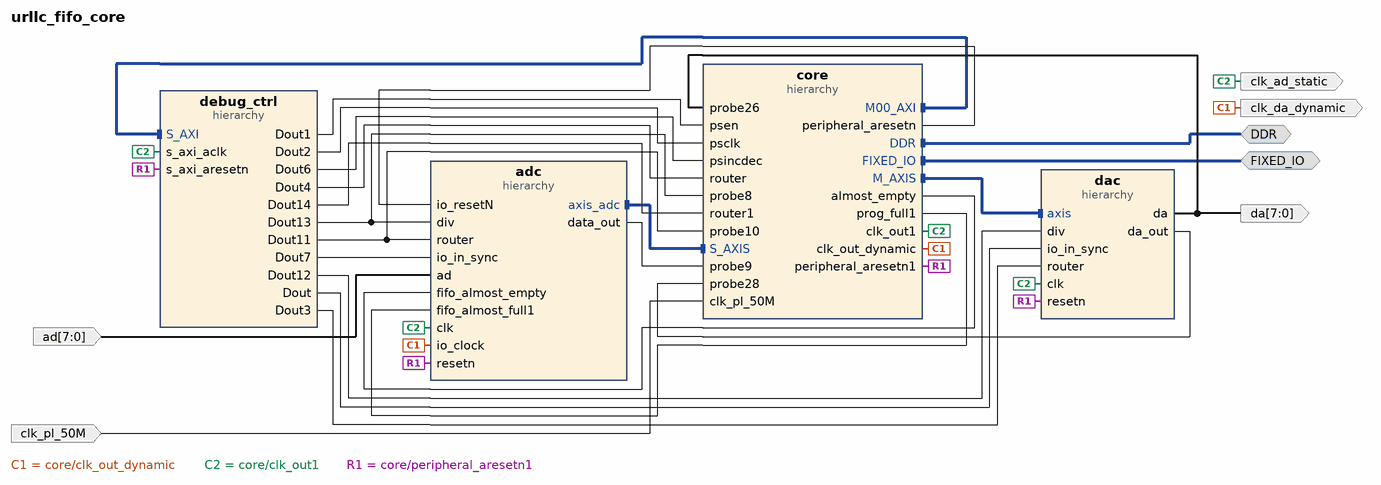
[diagram p0: block diagram of the top level]
# Vivado block design urllc_fifo_core, xc7z020clg400-2, Vivado 2018.3
create_bd_design urllc_fifo_core

create_bd_intf_port -mode Master -vlnv xilinx.com:interface:ddrx_rtl:1.0 DDR
create_bd_intf_port -mode Master -vlnv xilinx.com:display_processing_system7:fixedio_rtl:1.0 FIXED_IO
create_bd_port -dir I -from 7 -to 0 ad
create_bd_port -dir O -type clk clk_ad_static
set_property -dict {CONFIG.FREQ_HZ 60000000} [get_bd_ports clk_ad_static]
create_bd_port -dir O -type clk clk_da_dynamic
set_property -dict {CONFIG.FREQ_HZ 60000000} [get_bd_ports clk_da_dynamic]
create_bd_port -dir I -type clk clk_pl_50M
set_property -dict {CONFIG.FREQ_HZ 50000000} [get_bd_ports clk_pl_50M]
create_bd_port -dir O -from 7 -to 0 da

create_bd_cell -type hier adc
create_bd_cell -type hier core
create_bd_cell -type hier dac
create_bd_cell -type hier debug_ctrl

# ---- hierarchy /adc ----
current_bd_instance /adc
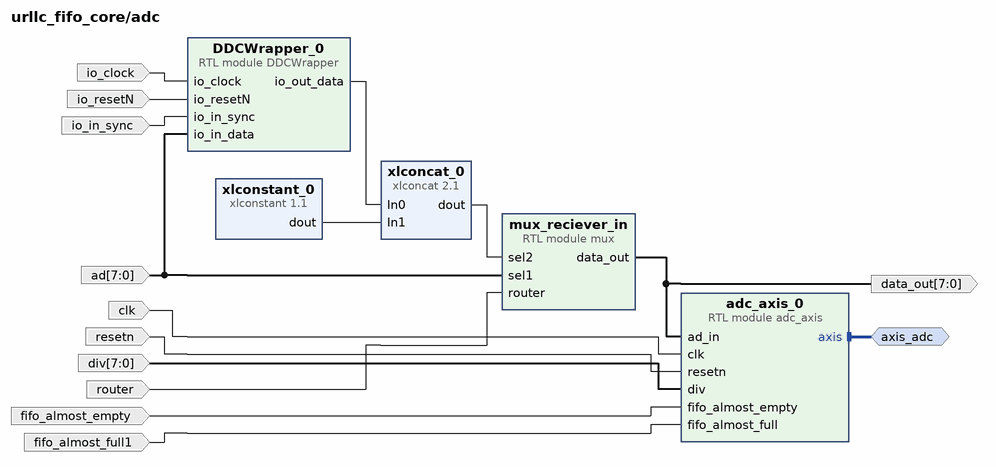
[diagram p1: block diagram inside /adc]
create_bd_intf_pin -mode Master -vlnv xilinx.com:interface:axis_rtl:1.0 axis_adc
create_bd_pin -dir I -from 7 -to 0 ad
create_bd_pin -dir I -type clk clk
create_bd_pin -dir I -from 7 -to 0 div
create_bd_pin -dir I -type clk io_clock
create_bd_pin -dir I io_in_sync
create_bd_pin -dir I -type rst io_resetN
create_bd_pin -dir I -type rst resetn
create_bd_pin -dir I router
create_bd_pin -dir O -from 7 -to 0 data_out
create_bd_pin -dir I fifo_almost_empty
create_bd_pin -dir I fifo_almost_full1

create_bd_cell -type module -reference DDCWrapper DDCWrapper_0
create_bd_cell -type ip -vlnv xilinx.com:ip:xlconcat:2.1 xlconcat_0
create_bd_cell -type ip -vlnv xilinx.com:ip:xlconstant:1.1 xlconstant_0
set_property -dict {CONFIG.CONST_VAL 0 CONFIG.CONST_WIDTH 7} [get_bd_cells xlconstant_0]
create_bd_cell -type module -reference adc_axis adc_axis_0
create_bd_cell -type module -reference mux mux_reciever_in

# ---- hierarchy /core ----
current_bd_instance /core
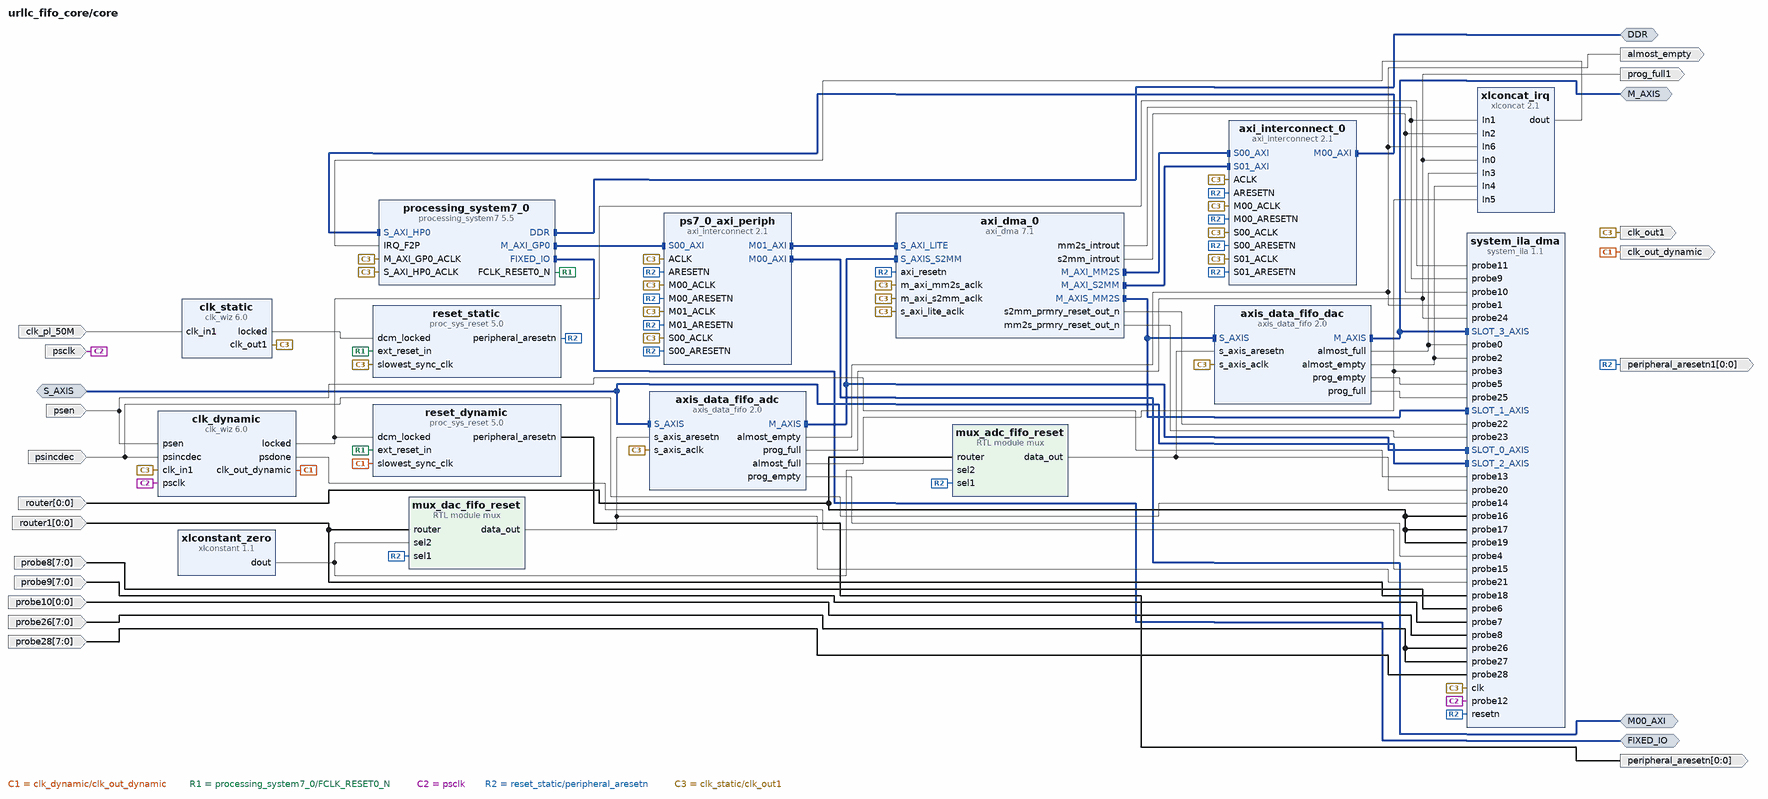
[diagram p2: block diagram inside /core]
create_bd_intf_pin -mode Master -vlnv xilinx.com:interface:ddrx_rtl:1.0 DDR
create_bd_intf_pin -mode Master -vlnv xilinx.com:display_processing_system7:fixedio_rtl:1.0 FIXED_IO
create_bd_intf_pin -mode Master -vlnv xilinx.com:interface:aximm_rtl:1.0 M00_AXI
create_bd_intf_pin -mode Slave -vlnv xilinx.com:interface:axis_rtl:1.0 S_AXIS
create_bd_intf_pin -mode Master -vlnv xilinx.com:interface:axis_rtl:1.0 M_AXIS
create_bd_pin -dir O -type clk clk_out1
create_bd_pin -dir O -type clk clk_out_dynamic
create_bd_pin -dir I clk_pl_50M
create_bd_pin -dir O -from 0 -to 0 -type rst peripheral_aresetn
create_bd_pin -dir O -from 0 -to 0 -type rst peripheral_aresetn1
create_bd_pin -dir I psclk
create_bd_pin -dir I psen
create_bd_pin -dir I psincdec
create_bd_pin -dir I -from 0 -to 0 router
create_bd_pin -dir I -from 0 -to 0 router1
create_bd_pin -dir I -from 7 -to 0 probe8
create_bd_pin -dir I -from 7 -to 0 probe9
create_bd_pin -dir I -from 0 -to 0 probe10
create_bd_pin -dir I -from 7 -to 0 probe26
create_bd_pin -dir I -from 7 -to 0 probe28
create_bd_pin -dir O almost_empty
create_bd_pin -dir O prog_full1

create_bd_cell -type ip -vlnv xilinx.com:ip:axi_dma:7.1 axi_dma_0
set_property -dict [list \
  CONFIG.c_include_sg 0 \
  CONFIG.c_m_axis_mm2s_tdata_width 8 \
  CONFIG.c_mm2s_burst_size 256 \
  CONFIG.c_s2mm_burst_size 256 \
  CONFIG.c_sg_length_width 24 \
] [get_bd_cells axi_dma_0]
create_bd_cell -type ip -vlnv xilinx.com:ip:clk_wiz:6.0 clk_dynamic
set_property -dict [list \
  CONFIG.CLKIN1_JITTER_PS 166.66 \
  CONFIG.CLKOUT1_JITTER 163.829 \
  CONFIG.CLKOUT1_PHASE_ERROR 130.371 \
  CONFIG.CLKOUT1_REQUESTED_OUT_FREQ 60 \
  CONFIG.CLK_OUT1_PORT clk_out_dynamic \
  CONFIG.MMCM_CLKFBOUT_MULT_F 17.000 \
  CONFIG.MMCM_CLKIN1_PERIOD 16.667 \
  CONFIG.MMCM_CLKIN2_PERIOD 10.0 \
  CONFIG.MMCM_CLKOUT0_DIVIDE_F 17.000 \
  CONFIG.MMCM_DIVCLK_DIVIDE 1 \
  CONFIG.PRIM_IN_FREQ 60.000 \
  CONFIG.PRIM_SOURCE Global_buffer \
  CONFIG.RESET_PORT reset \
  CONFIG.RESET_TYPE ACTIVE_HIGH \
  CONFIG.USE_DYN_PHASE_SHIFT true \
  CONFIG.USE_RESET false \
] [get_bd_cells clk_dynamic]
create_bd_cell -type ip -vlnv xilinx.com:ip:clk_wiz:6.0 clk_static
set_property -dict [list \
  CONFIG.CLKIN1_JITTER_PS 200.0 \
  CONFIG.CLKOUT1_JITTER 180.523 \
  CONFIG.CLKOUT1_PHASE_ERROR 162.874 \
  CONFIG.CLKOUT1_REQUESTED_OUT_FREQ 60.000 \
  CONFIG.MMCM_CLKFBOUT_MULT_F 20.250 \
  CONFIG.MMCM_CLKIN1_PERIOD 20.000 \
  CONFIG.MMCM_CLKIN2_PERIOD 10.0 \
  CONFIG.MMCM_CLKOUT0_DIVIDE_F 16.875 \
  CONFIG.MMCM_DIVCLK_DIVIDE 1 \
  CONFIG.PRIM_SOURCE Single_ended_clock_capable_pin \
  CONFIG.RESET_PORT reset \
  CONFIG.RESET_TYPE ACTIVE_HIGH \
  CONFIG.USE_RESET false \
] [get_bd_cells clk_static]
create_bd_cell -type ip -vlnv xilinx.com:ip:processing_system7:5.5 processing_system7_0
set_property -dict [list \
  CONFIG.PCW_APU_PERIPHERAL_FREQMHZ 666.666666 \
  CONFIG.PCW_CPU_CPU_6X4X_MAX_RANGE 767 \
  CONFIG.PCW_ENET0_ENET0_IO {MIO 16 .. 27} \
  CONFIG.PCW_ENET0_GRP_MDIO_ENABLE 1 \
  CONFIG.PCW_ENET0_GRP_MDIO_IO EMIO \
  CONFIG.PCW_ENET0_PERIPHERAL_ENABLE 1 \
  CONFIG.PCW_EN_CLK0_PORT 0 \
  CONFIG.PCW_FPGA0_PERIPHERAL_FREQMHZ 50 \
  CONFIG.PCW_FPGA1_PERIPHERAL_FREQMHZ 50 \
  CONFIG.PCW_GPIO_MIO_GPIO_ENABLE 0 \
  CONFIG.PCW_IRQ_F2P_INTR 1 \
  CONFIG.PCW_PERIPHERAL_BOARD_PRESET None \
  CONFIG.PCW_PRESET_BANK1_VOLTAGE {LVCMOS 1.8V} \
  CONFIG.PCW_QSPI_GRP_SINGLE_SS_ENABLE 1 \
  CONFIG.PCW_QSPI_GRP_SINGLE_SS_IO {MIO 1 .. 6} \
  CONFIG.PCW_QSPI_PERIPHERAL_ENABLE 1 \
  CONFIG.PCW_QSPI_QSPI_IO {MIO 1 .. 6} \
  CONFIG.PCW_SD0_GRP_CD_ENABLE 0 \
  CONFIG.PCW_SD0_GRP_WP_ENABLE 0 \
  CONFIG.PCW_SD0_PERIPHERAL_ENABLE 1 \
  CONFIG.PCW_SD0_SD0_IO {MIO 40 .. 45} \
  CONFIG.PCW_SDIO_PERIPHERAL_FREQMHZ 100 \
  CONFIG.PCW_SINGLE_QSPI_DATA_MODE x4 \
  CONFIG.PCW_UART1_PERIPHERAL_ENABLE 1 \
  CONFIG.PCW_UART1_UART1_IO {MIO 48 .. 49} \
  CONFIG.PCW_UART_PERIPHERAL_FREQMHZ 100 \
  CONFIG.PCW_UIPARAM_DDR_BUS_WIDTH {16 Bit} \
  CONFIG.PCW_UIPARAM_DDR_FREQ_MHZ 533.333333 \
  CONFIG.PCW_UIPARAM_DDR_PARTNO {MT41J256M16 RE-125} \
  CONFIG.PCW_USB0_PERIPHERAL_ENABLE 0 \
  CONFIG.PCW_USE_FABRIC_INTERRUPT 1 \
  CONFIG.PCW_USE_S_AXI_HP0 1 \
] [get_bd_cells processing_system7_0]
# 422 more settings of processing_system7_0 are not shown: defaults, MIO pin electricals, DDR timing, and values the tool derives
create_bd_cell -type ip -vlnv xilinx.com:ip:axi_interconnect:2.1 ps7_0_axi_periph
set_property -dict {CONFIG.NUM_MI 2} [get_bd_cells ps7_0_axi_periph]
create_bd_cell -type ip -vlnv xilinx.com:ip:proc_sys_reset:5.0 reset_dynamic
create_bd_cell -type ip -vlnv xilinx.com:ip:proc_sys_reset:5.0 reset_static
create_bd_cell -type ip -vlnv xilinx.com:ip:xlconcat:2.1 xlconcat_irq
set_property -dict {CONFIG.NUM_PORTS 7} [get_bd_cells xlconcat_irq]
create_bd_cell -type ip -vlnv xilinx.com:ip:xlconstant:1.1 xlconstant_zero
set_property -dict {CONFIG.CONST_VAL 0} [get_bd_cells xlconstant_zero]
create_bd_cell -type ip -vlnv xilinx.com:ip:system_ila:1.1 system_ila_dma
set_property -dict [list \
  CONFIG.C_ADV_TRIGGER true \
  CONFIG.C_DATA_DEPTH 8192 \
  CONFIG.C_MON_TYPE MIX \
  CONFIG.C_NUM_MONITOR_SLOTS 4 \
  CONFIG.C_NUM_OF_PROBES 29 \
  CONFIG.C_PROBE0_TYPE 0 \
  CONFIG.C_PROBE10_TYPE 0 \
  CONFIG.C_PROBE11_TYPE 0 \
  CONFIG.C_PROBE12_TYPE 0 \
  CONFIG.C_PROBE13_TYPE 0 \
  CONFIG.C_PROBE14_TYPE 0 \
  CONFIG.C_PROBE15_TYPE 0 \
  CONFIG.C_PROBE16_TYPE 0 \
  CONFIG.C_PROBE17_TYPE 0 \
  CONFIG.C_PROBE18_TYPE 0 \
  CONFIG.C_PROBE19_TYPE 0 \
  CONFIG.C_PROBE1_TYPE 0 \
  CONFIG.C_PROBE20_TYPE 0 \
  CONFIG.C_PROBE21_TYPE 0 \
  CONFIG.C_PROBE22_TYPE 0 \
  CONFIG.C_PROBE23_TYPE 0 \
  CONFIG.C_PROBE24_TYPE 0 \
  CONFIG.C_PROBE25_TYPE 0 \
  CONFIG.C_PROBE26_TYPE 0 \
  CONFIG.C_PROBE27_TYPE 0 \
  CONFIG.C_PROBE28_TYPE 0 \
  CONFIG.C_PROBE2_TYPE 0 \
  CONFIG.C_PROBE3_TYPE 0 \
  CONFIG.C_PROBE4_TYPE 0 \
  CONFIG.C_PROBE5_TYPE 0 \
  CONFIG.C_PROBE6_TYPE 0 \
  CONFIG.C_PROBE7_TYPE 0 \
  CONFIG.C_PROBE8_TYPE 0 \
  CONFIG.C_PROBE9_TYPE 0 \
  CONFIG.C_SLOT 3 \
  CONFIG.C_SLOT_0_APC_EN 0 \
  CONFIG.C_SLOT_0_INTF_TYPE xilinx.com:interface:axis_rtl:1.0 \
  CONFIG.C_SLOT_1_INTF_TYPE xilinx.com:interface:axis_rtl:1.0 \
  CONFIG.C_SLOT_2_INTF_TYPE xilinx.com:interface:axis_rtl:1.0 \
  CONFIG.C_SLOT_3_INTF_TYPE xilinx.com:interface:axis_rtl:1.0 \
  CONFIG.C_SLOT_4_APC_EN 0 \
  CONFIG.C_SLOT_4_AXI_AR_SEL_DATA 1 \
  CONFIG.C_SLOT_4_AXI_AR_SEL_TRIG 1 \
  CONFIG.C_SLOT_4_AXI_AW_SEL_DATA 1 \
  CONFIG.C_SLOT_4_AXI_AW_SEL_TRIG 1 \
  CONFIG.C_SLOT_4_AXI_B_SEL_DATA 1 \
  CONFIG.C_SLOT_4_AXI_B_SEL_TRIG 1 \
  CONFIG.C_SLOT_4_AXI_R_SEL_DATA 1 \
  CONFIG.C_SLOT_4_AXI_R_SEL_TRIG 1 \
  CONFIG.C_SLOT_4_AXI_W_SEL_DATA 1 \
  CONFIG.C_SLOT_4_AXI_W_SEL_TRIG 1 \
  CONFIG.C_SLOT_4_INTF_TYPE xilinx.com:interface:aximm_rtl:1.0 \
  CONFIG.C_SLOT_4_TYPE 0 \
  CONFIG.C_SLOT_5_APC_EN 0 \
  CONFIG.C_SLOT_5_AXI_AR_SEL_DATA 1 \
  CONFIG.C_SLOT_5_AXI_AR_SEL_TRIG 1 \
  CONFIG.C_SLOT_5_AXI_AW_SEL_DATA 1 \
  CONFIG.C_SLOT_5_AXI_AW_SEL_TRIG 1 \
  CONFIG.C_SLOT_5_AXI_B_SEL_DATA 1 \
  CONFIG.C_SLOT_5_AXI_B_SEL_TRIG 1 \
  CONFIG.C_SLOT_5_AXI_R_SEL_DATA 1 \
  CONFIG.C_SLOT_5_AXI_R_SEL_TRIG 1 \
  CONFIG.C_SLOT_5_AXI_W_SEL_DATA 1 \
  CONFIG.C_SLOT_5_AXI_W_SEL_TRIG 1 \
  CONFIG.C_SLOT_5_INTF_TYPE xilinx.com:interface:aximm_rtl:1.0 \
  CONFIG.C_SLOT_5_TYPE 0 \
  CONFIG.C_SLOT_6_APC_EN 0 \
  CONFIG.C_SLOT_6_AXI_AR_SEL_DATA 1 \
  CONFIG.C_SLOT_6_AXI_AR_SEL_TRIG 1 \
  CONFIG.C_SLOT_6_AXI_AW_SEL_DATA 1 \
  CONFIG.C_SLOT_6_AXI_AW_SEL_TRIG 1 \
  CONFIG.C_SLOT_6_AXI_B_SEL_DATA 1 \
  CONFIG.C_SLOT_6_AXI_B_SEL_TRIG 1 \
  CONFIG.C_SLOT_6_AXI_R_SEL_DATA 1 \
  CONFIG.C_SLOT_6_AXI_R_SEL_TRIG 1 \
  CONFIG.C_SLOT_6_AXI_W_SEL_DATA 1 \
  CONFIG.C_SLOT_6_AXI_W_SEL_TRIG 1 \
  CONFIG.C_SLOT_6_INTF_TYPE xilinx.com:interface:aximm_rtl:1.0 \
] [get_bd_cells system_ila_dma]
create_bd_cell -type ip -vlnv xilinx.com:ip:axi_interconnect:2.1 axi_interconnect_0
set_property -dict {CONFIG.NUM_MI 1 CONFIG.NUM_SI 2} [get_bd_cells axi_interconnect_0]
create_bd_cell -type ip -vlnv xilinx.com:ip:axis_data_fifo:2.0 axis_data_fifo_dac
set_property -dict [list \
  CONFIG.FIFO_DEPTH 16384 \
  CONFIG.HAS_AEMPTY 1 \
  CONFIG.HAS_AFULL 1 \
  CONFIG.HAS_PROG_EMPTY 1 \
  CONFIG.HAS_PROG_FULL 1 \
  CONFIG.HAS_WR_DATA_COUNT 0 \
  CONFIG.PROG_FULL_THRESH 2048 \
] [get_bd_cells axis_data_fifo_dac]
create_bd_cell -type ip -vlnv xilinx.com:ip:axis_data_fifo:2.0 axis_data_fifo_adc
set_property -dict [list \
  CONFIG.FIFO_DEPTH 16384 \
  CONFIG.HAS_AEMPTY 1 \
  CONFIG.HAS_AFULL 1 \
  CONFIG.HAS_PROG_EMPTY 1 \
  CONFIG.HAS_PROG_FULL 1 \
  CONFIG.HAS_WR_DATA_COUNT 0 \
  CONFIG.PROG_FULL_THRESH 2048 \
] [get_bd_cells axis_data_fifo_adc]
create_bd_cell -type module -reference mux mux_adc_fifo_reset
set_property -dict {CONFIG.N 1} [get_bd_cells mux_adc_fifo_reset]
create_bd_cell -type module -reference mux mux_dac_fifo_reset
set_property -dict {CONFIG.N 1} [get_bd_cells mux_dac_fifo_reset]

# ---- hierarchy /dac ----
current_bd_instance /dac
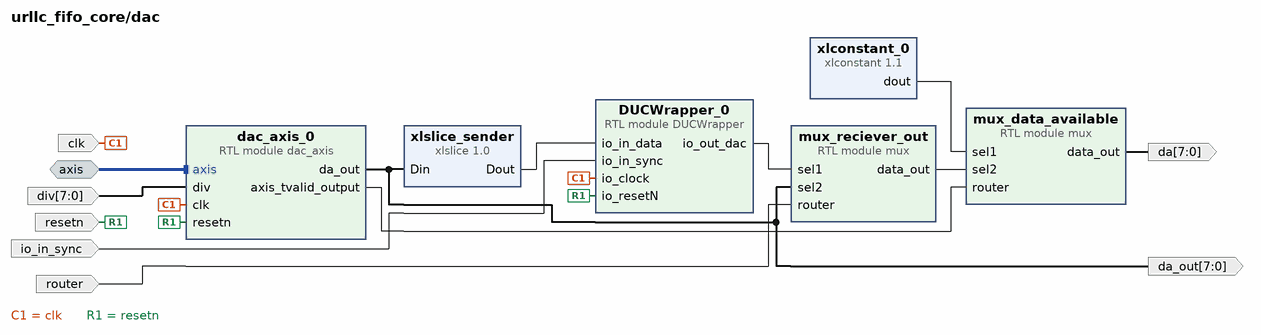
[diagram p3: block diagram inside /dac]
create_bd_intf_pin -mode Slave -vlnv xilinx.com:interface:axis_rtl:1.0 axis
create_bd_pin -dir I -type clk clk
create_bd_pin -dir O -from 7 -to 0 da
create_bd_pin -dir I -from 7 -to 0 div
create_bd_pin -dir I io_in_sync
create_bd_pin -dir I -type rst resetn
create_bd_pin -dir I router
create_bd_pin -dir O -from 7 -to 0 da_out

create_bd_cell -type module -reference DUCWrapper DUCWrapper_0
create_bd_cell -type module -reference mux mux_reciever_out
create_bd_cell -type ip -vlnv xilinx.com:ip:xlslice:1.0 xlslice_sender
set_property -dict {CONFIG.DIN_FROM 0 CONFIG.DIN_TO 0 CONFIG.DIN_WIDTH 8} [get_bd_cells xlslice_sender]
create_bd_cell -type ip -vlnv xilinx.com:ip:xlconstant:1.1 xlconstant_0
set_property -dict {CONFIG.CONST_VAL 127 CONFIG.CONST_WIDTH 8} [get_bd_cells xlconstant_0]
create_bd_cell -type module -reference mux mux_data_available
create_bd_cell -type module -reference dac_axis dac_axis_0

# ---- hierarchy /debug_ctrl ----
current_bd_instance /debug_ctrl
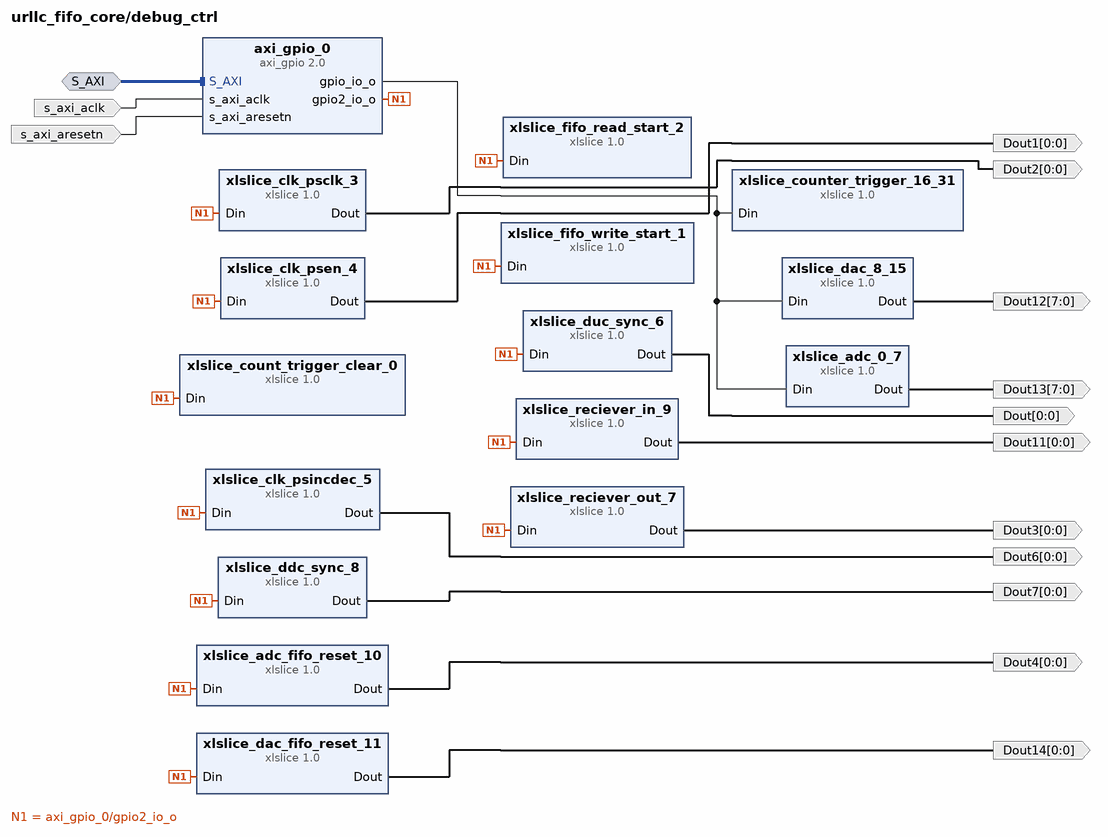
[diagram p4: block diagram inside /debug_ctrl]
create_bd_intf_pin -mode Slave -vlnv xilinx.com:interface:aximm_rtl:1.0 S_AXI
create_bd_pin -dir O -from 0 -to 0 Dout
create_bd_pin -dir O -from 0 -to 0 Dout1
create_bd_pin -dir O -from 0 -to 0 Dout2
create_bd_pin -dir O -from 0 -to 0 Dout3
create_bd_pin -dir O -from 0 -to 0 Dout6
create_bd_pin -dir O -from 0 -to 0 Dout7
create_bd_pin -dir O -from 0 -to 0 Dout11
create_bd_pin -dir O -from 7 -to 0 Dout12
create_bd_pin -dir O -from 7 -to 0 Dout13
create_bd_pin -dir I -type clk s_axi_aclk
create_bd_pin -dir I -type rst s_axi_aresetn
create_bd_pin -dir O -from 0 -to 0 Dout4
create_bd_pin -dir O -from 0 -to 0 Dout14

create_bd_cell -type ip -vlnv xilinx.com:ip:axi_gpio:2.0 axi_gpio_0
set_property -dict {CONFIG.C_ALL_OUTPUTS 1 CONFIG.C_ALL_OUTPUTS_2 1 CONFIG.C_IS_DUAL 1} [get_bd_cells axi_gpio_0]
create_bd_cell -type ip -vlnv xilinx.com:ip:xlslice:1.0 xlslice_adc_0_7
set_property -dict {CONFIG.DIN_FROM 7 CONFIG.DOUT_WIDTH 8} [get_bd_cells xlslice_adc_0_7]
create_bd_cell -type ip -vlnv xilinx.com:ip:xlslice:1.0 xlslice_clk_psclk_3
set_property -dict {CONFIG.DIN_FROM 3 CONFIG.DIN_TO 3 CONFIG.DOUT_WIDTH 1} [get_bd_cells xlslice_clk_psclk_3]
create_bd_cell -type ip -vlnv xilinx.com:ip:xlslice:1.0 xlslice_clk_psen_4
set_property -dict {CONFIG.DIN_FROM 4 CONFIG.DIN_TO 4 CONFIG.DOUT_WIDTH 1} [get_bd_cells xlslice_clk_psen_4]
create_bd_cell -type ip -vlnv xilinx.com:ip:xlslice:1.0 xlslice_clk_psincdec_5
set_property -dict {CONFIG.DIN_FROM 5 CONFIG.DIN_TO 5 CONFIG.DOUT_WIDTH 1} [get_bd_cells xlslice_clk_psincdec_5]
create_bd_cell -type ip -vlnv xilinx.com:ip:xlslice:1.0 xlslice_count_trigger_clear_0
set_property -dict {CONFIG.DIN_FROM 0 CONFIG.DIN_TO 0 CONFIG.DOUT_WIDTH 1} [get_bd_cells xlslice_count_trigger_clear_0]
create_bd_cell -type ip -vlnv xilinx.com:ip:xlslice:1.0 xlslice_counter_trigger_16_31
set_property -dict {CONFIG.DIN_FROM 31 CONFIG.DIN_TO 16 CONFIG.DOUT_WIDTH 16} [get_bd_cells xlslice_counter_trigger_16_31]
create_bd_cell -type ip -vlnv xilinx.com:ip:xlslice:1.0 xlslice_dac_8_15
set_property -dict {CONFIG.DIN_FROM 15 CONFIG.DIN_TO 8 CONFIG.DOUT_WIDTH 8} [get_bd_cells xlslice_dac_8_15]
create_bd_cell -type ip -vlnv xilinx.com:ip:xlslice:1.0 xlslice_ddc_sync_8
set_property -dict {CONFIG.DIN_FROM 8 CONFIG.DIN_TO 8 CONFIG.DOUT_WIDTH 1} [get_bd_cells xlslice_ddc_sync_8]
create_bd_cell -type ip -vlnv xilinx.com:ip:xlslice:1.0 xlslice_duc_sync_6
set_property -dict {CONFIG.DIN_FROM 6 CONFIG.DIN_TO 6 CONFIG.DOUT_WIDTH 1} [get_bd_cells xlslice_duc_sync_6]
create_bd_cell -type ip -vlnv xilinx.com:ip:xlslice:1.0 xlslice_fifo_read_start_2
set_property -dict {CONFIG.DIN_FROM 2 CONFIG.DIN_TO 2 CONFIG.DOUT_WIDTH 1} [get_bd_cells xlslice_fifo_read_start_2]
create_bd_cell -type ip -vlnv xilinx.com:ip:xlslice:1.0 xlslice_fifo_write_start_1
set_property -dict {CONFIG.DIN_FROM 1 CONFIG.DIN_TO 1 CONFIG.DOUT_WIDTH 1} [get_bd_cells xlslice_fifo_write_start_1]
create_bd_cell -type ip -vlnv xilinx.com:ip:xlslice:1.0 xlslice_reciever_in_9
set_property -dict {CONFIG.DIN_FROM 9 CONFIG.DIN_TO 9 CONFIG.DOUT_WIDTH 1} [get_bd_cells xlslice_reciever_in_9]
create_bd_cell -type ip -vlnv xilinx.com:ip:xlslice:1.0 xlslice_reciever_out_7
set_property -dict {CONFIG.DIN_FROM 7 CONFIG.DIN_TO 7 CONFIG.DOUT_WIDTH 1} [get_bd_cells xlslice_reciever_out_7]
create_bd_cell -type ip -vlnv xilinx.com:ip:xlslice:1.0 xlslice_adc_fifo_reset_10
set_property -dict {CONFIG.DIN_FROM 10 CONFIG.DIN_TO 10 CONFIG.DOUT_WIDTH 1} [get_bd_cells xlslice_adc_fifo_reset_10]
create_bd_cell -type ip -vlnv xilinx.com:ip:xlslice:1.0 xlslice_dac_fifo_reset_11
set_property -dict {CONFIG.DIN_FROM 11 CONFIG.DIN_TO 11 CONFIG.DOUT_WIDTH 1} [get_bd_cells xlslice_dac_fifo_reset_11]

# ---- connections ----

current_bd_instance /adc
connect_bd_intf_net -intf_net adc_axis_0_axis [get_bd_intf_pins axis_adc] [get_bd_intf_pins adc_axis_0/axis]
connect_bd_net [get_bd_pins DDCWrapper_0/io_out_data] [get_bd_pins xlconcat_0/In0]
connect_bd_net [get_bd_pins clk] [get_bd_pins adc_axis_0/clk]
connect_bd_net [get_bd_pins resetn] [get_bd_pins adc_axis_0/resetn]
connect_bd_net [get_bd_pins io_clock] [get_bd_pins DDCWrapper_0/io_clock]
connect_bd_net [get_bd_pins io_resetN] [get_bd_pins DDCWrapper_0/io_resetN]
connect_bd_net [get_bd_pins ad] [get_bd_pins DDCWrapper_0/io_in_data] [get_bd_pins mux_reciever_in/sel1]
connect_bd_net -net div_1 [get_bd_pins div] [get_bd_pins adc_axis_0/div]
connect_bd_net [get_bd_pins io_in_sync] [get_bd_pins DDCWrapper_0/io_in_sync]
connect_bd_net -net mux_reciever_in_data_out [get_bd_pins mux_reciever_in/data_out] [get_bd_pins data_out] [get_bd_pins adc_axis_0/ad_in]
connect_bd_net [get_bd_pins xlconstant_0/dout] [get_bd_pins xlconcat_0/In1]
connect_bd_net -net fifo_almost_empty_1 [get_bd_pins fifo_almost_empty] [get_bd_pins adc_axis_0/fifo_almost_empty]
connect_bd_net -net fifo_almost_full1_1 [get_bd_pins fifo_almost_full1] [get_bd_pins adc_axis_0/fifo_almost_full]
connect_bd_net -net router_1 [get_bd_pins router] [get_bd_pins mux_reciever_in/router]
connect_bd_net [get_bd_pins xlconcat_0/dout] [get_bd_pins mux_reciever_in/sel2]
set_property HDL_ATTRIBUTE.DEBUG true [get_bd_intf_nets adc_axis_0_axis]
set_property HDL_ATTRIBUTE.DEBUG true [get_bd_nets div_1]
set_property HDL_ATTRIBUTE.MARK_DEBUG true [get_bd_nets div_1]
set_property HDL_ATTRIBUTE.DEBUG true [get_bd_nets mux_reciever_in_data_out]
set_property HDL_ATTRIBUTE.MARK_DEBUG true [get_bd_nets mux_reciever_in_data_out]
set_property HDL_ATTRIBUTE.DEBUG true [get_bd_nets fifo_almost_empty_1]
set_property HDL_ATTRIBUTE.DEBUG true [get_bd_nets fifo_almost_full1_1]
set_property HDL_ATTRIBUTE.DEBUG true [get_bd_nets router_1]

current_bd_instance /core
connect_bd_intf_net [get_bd_intf_pins axi_dma_0/S_AXI_LITE] [get_bd_intf_pins ps7_0_axi_periph/M01_AXI]
connect_bd_intf_net -intf_net axis_data_fifo_adc_M_AXIS [get_bd_intf_pins M_AXIS] [get_bd_intf_pins axis_data_fifo_dac/M_AXIS]
connect_bd_intf_net [get_bd_intf_pins M_AXIS] [get_bd_intf_pins system_ila_dma/SLOT_3_AXIS]
connect_bd_intf_net [get_bd_intf_pins axi_interconnect_0/S00_AXI] [get_bd_intf_pins axi_dma_0/M_AXI_MM2S]
connect_bd_intf_net [get_bd_intf_pins DDR] [get_bd_intf_pins processing_system7_0/DDR]
connect_bd_intf_net [get_bd_intf_pins processing_system7_0/M_AXI_GP0] [get_bd_intf_pins ps7_0_axi_periph/S00_AXI]
connect_bd_intf_net [get_bd_intf_pins M00_AXI] [get_bd_intf_pins ps7_0_axi_periph/M00_AXI]
connect_bd_intf_net -intf_net axis_data_fifo_dac_M_AXIS [get_bd_intf_pins axis_data_fifo_adc/M_AXIS] [get_bd_intf_pins axi_dma_0/S_AXIS_S2MM]
connect_bd_intf_net [get_bd_intf_pins axis_data_fifo_adc/M_AXIS] [get_bd_intf_pins system_ila_dma/SLOT_0_AXIS]
connect_bd_intf_net [get_bd_intf_pins axi_interconnect_0/M00_AXI] [get_bd_intf_pins processing_system7_0/S_AXI_HP0]
connect_bd_intf_net -intf_net S_AXIS_1 [get_bd_intf_pins S_AXIS] [get_bd_intf_pins axis_data_fifo_adc/S_AXIS]
connect_bd_intf_net [get_bd_intf_pins S_AXIS] [get_bd_intf_pins system_ila_dma/SLOT_2_AXIS]
connect_bd_intf_net [get_bd_intf_pins FIXED_IO] [get_bd_intf_pins processing_system7_0/FIXED_IO]
connect_bd_intf_net -intf_net axi_dma_0_M_AXIS_MM2S [get_bd_intf_pins axi_dma_0/M_AXIS_MM2S] [get_bd_intf_pins axis_data_fifo_dac/S_AXIS]
connect_bd_intf_net [get_bd_intf_pins axi_dma_0/M_AXIS_MM2S] [get_bd_intf_pins system_ila_dma/SLOT_1_AXIS]
connect_bd_intf_net [get_bd_intf_pins axi_interconnect_0/S01_AXI] [get_bd_intf_pins axi_dma_0/M_AXI_S2MM]
connect_bd_net -net axi_dma_0_mm2s_introut [get_bd_pins axi_dma_0/mm2s_introut] [get_bd_pins xlconcat_irq/In1] [get_bd_pins system_ila_dma/probe9]
connect_bd_net -net axi_dma_0_s2mm_introut [get_bd_pins axi_dma_0/s2mm_introut] [get_bd_pins xlconcat_irq/In2] [get_bd_pins system_ila_dma/probe10]
connect_bd_net -net clk_dynamic_clk_out_200M [get_bd_pins clk_dynamic/clk_out_dynamic] \
  [get_bd_pins clk_out_dynamic] [get_bd_pins reset_dynamic/slowest_sync_clk]
connect_bd_net -net clk_dynamic_locked [get_bd_pins clk_dynamic/locked] [get_bd_pins reset_dynamic/dcm_locked] [get_bd_pins system_ila_dma/probe11]
connect_bd_net [get_bd_pins clk_pl_50M] [get_bd_pins clk_static/clk_in1]
connect_bd_net [get_bd_pins clk_static/locked] [get_bd_pins reset_static/dcm_locked]
connect_bd_net [get_bd_pins processing_system7_0/FCLK_RESET0_N] [get_bd_pins reset_dynamic/ext_reset_in] [get_bd_pins reset_static/ext_reset_in]
connect_bd_net -net psclk_1 [get_bd_pins psclk] [get_bd_pins clk_dynamic/psclk] [get_bd_pins system_ila_dma/probe12]
connect_bd_net -net psen_1 [get_bd_pins psen] [get_bd_pins clk_dynamic/psen] [get_bd_pins system_ila_dma/probe13]
connect_bd_net -net psincdec_1 [get_bd_pins psincdec] [get_bd_pins clk_dynamic/psincdec] [get_bd_pins system_ila_dma/probe14]
connect_bd_net [get_bd_pins reset_dynamic/peripheral_aresetn] [get_bd_pins peripheral_aresetn]
connect_bd_net -net rst_ps7_0_50M_peripheral_aresetn [get_bd_pins reset_static/peripheral_aresetn] \
  [get_bd_pins peripheral_aresetn1] [get_bd_pins axi_dma_0/axi_resetn] [get_bd_pins ps7_0_axi_periph/ARESETN] \
  [get_bd_pins ps7_0_axi_periph/M00_ARESETN] [get_bd_pins ps7_0_axi_periph/M01_ARESETN] \
  [get_bd_pins ps7_0_axi_periph/S00_ARESETN] [get_bd_pins system_ila_dma/resetn] [get_bd_pins axi_interconnect_0/S01_ARESETN] \
  [get_bd_pins axi_interconnect_0/S00_ARESETN] [get_bd_pins axi_interconnect_0/M00_ARESETN] \
  [get_bd_pins axi_interconnect_0/ARESETN] [get_bd_pins mux_dac_fifo_reset/sel1] [get_bd_pins mux_adc_fifo_reset/sel1]
connect_bd_net [get_bd_pins xlconcat_irq/dout] [get_bd_pins processing_system7_0/IRQ_F2P]
connect_bd_net -net xlconstant_one_dout [get_bd_pins xlconstant_zero/dout] [get_bd_pins mux_adc_fifo_reset/sel2] [get_bd_pins mux_dac_fifo_reset/sel2]
connect_bd_net -net Net [get_bd_pins router] \
  [get_bd_pins mux_adc_fifo_reset/router] [get_bd_pins system_ila_dma/probe16] [get_bd_pins system_ila_dma/probe17] \
  [get_bd_pins system_ila_dma/probe19]
connect_bd_net -net Net1 [get_bd_pins router1] [get_bd_pins mux_dac_fifo_reset/router] [get_bd_pins system_ila_dma/probe18]
connect_bd_net [get_bd_pins clk_static/clk_out1] \
  [get_bd_pins clk_out1] [get_bd_pins axi_dma_0/m_axi_mm2s_aclk] [get_bd_pins axi_dma_0/m_axi_s2mm_aclk] \
  [get_bd_pins axi_dma_0/s_axi_lite_aclk] [get_bd_pins clk_dynamic/clk_in1] [get_bd_pins processing_system7_0/M_AXI_GP0_ACLK] \
  [get_bd_pins ps7_0_axi_periph/ACLK] [get_bd_pins ps7_0_axi_periph/M00_ACLK] [get_bd_pins ps7_0_axi_periph/M01_ACLK] \
  [get_bd_pins ps7_0_axi_periph/S00_ACLK] [get_bd_pins reset_static/slowest_sync_clk] [get_bd_pins system_ila_dma/clk] \
  [get_bd_pins processing_system7_0/S_AXI_HP0_ACLK] [get_bd_pins axi_interconnect_0/M00_ACLK] \
  [get_bd_pins axi_interconnect_0/ACLK] [get_bd_pins axi_interconnect_0/S00_ACLK] [get_bd_pins axi_interconnect_0/S01_ACLK] \
  [get_bd_pins axis_data_fifo_dac/s_axis_aclk] [get_bd_pins axis_data_fifo_adc/s_axis_aclk]
connect_bd_net -net axis_data_fifo_adc_almost_full [get_bd_pins axis_data_fifo_dac/almost_full] \
  [get_bd_pins xlconcat_irq/In3] [get_bd_pins system_ila_dma/probe0]
connect_bd_net -net axis_data_fifo_dac_almost_empty [get_bd_pins axis_data_fifo_adc/almost_empty] \
  [get_bd_pins xlconcat_irq/In6] [get_bd_pins system_ila_dma/probe1] [get_bd_pins almost_empty]
connect_bd_net -net axis_data_fifo_adc_almost_empty [get_bd_pins axis_data_fifo_dac/almost_empty] \
  [get_bd_pins xlconcat_irq/In4] [get_bd_pins system_ila_dma/probe2]
connect_bd_net -net prog_empty [get_bd_pins axis_data_fifo_adc/prog_empty] [get_bd_pins system_ila_dma/probe4]
connect_bd_net -net prog_full [get_bd_pins axis_data_fifo_adc/prog_full] \
  [get_bd_pins xlconcat_irq/In0] [get_bd_pins system_ila_dma/probe24] [get_bd_pins prog_full1]
connect_bd_net -net prog_empty_1 [get_bd_pins axis_data_fifo_dac/prog_empty] [get_bd_pins system_ila_dma/probe5]
connect_bd_net -net probe8_1 [get_bd_pins probe8] [get_bd_pins system_ila_dma/probe6]
connect_bd_net -net probe9_1 [get_bd_pins probe9] [get_bd_pins system_ila_dma/probe7]
connect_bd_net -net probe10_1 [get_bd_pins probe10] [get_bd_pins system_ila_dma/probe8]
connect_bd_net -net psdone [get_bd_pins clk_dynamic/psdone] [get_bd_pins system_ila_dma/probe15]
connect_bd_net -net mux_adc_fifo_reset1_data_out [get_bd_pins mux_adc_fifo_reset/data_out] \
  [get_bd_pins axis_data_fifo_dac/s_axis_aresetn] [get_bd_pins system_ila_dma/probe20]
connect_bd_net -net mux_dac_fifo_reset1_data_out [get_bd_pins mux_dac_fifo_reset/data_out] \
  [get_bd_pins axis_data_fifo_adc/s_axis_aresetn] [get_bd_pins system_ila_dma/probe21]
connect_bd_net -net s2mm_prmry_reset_out_n [get_bd_pins axi_dma_0/s2mm_prmry_reset_out_n] [get_bd_pins system_ila_dma/probe22]
connect_bd_net -net mm2s_prmry_reset_out_n [get_bd_pins axi_dma_0/mm2s_prmry_reset_out_n] [get_bd_pins system_ila_dma/probe23]
connect_bd_net -net prog_full_1 [get_bd_pins axis_data_fifo_dac/prog_full] [get_bd_pins system_ila_dma/probe25]
connect_bd_net -net probe26_1 [get_bd_pins probe26] [get_bd_pins system_ila_dma/probe26] [get_bd_pins system_ila_dma/probe27]
connect_bd_net -net probe28_1 [get_bd_pins probe28] [get_bd_pins system_ila_dma/probe28]
connect_bd_net [get_bd_pins axis_data_fifo_adc/almost_full] [get_bd_pins xlconcat_irq/In5] [get_bd_pins system_ila_dma/probe3]
set_property HDL_ATTRIBUTE.DEBUG true [get_bd_intf_nets axis_data_fifo_adc_M_AXIS]
set_property HDL_ATTRIBUTE.MARK_DEBUG true [get_bd_intf_nets axis_data_fifo_adc_M_AXIS]
set_property HDL_ATTRIBUTE.DEBUG true [get_bd_intf_nets axis_data_fifo_dac_M_AXIS]
set_property HDL_ATTRIBUTE.MARK_DEBUG true [get_bd_intf_nets axis_data_fifo_dac_M_AXIS]
set_property HDL_ATTRIBUTE.DEBUG true [get_bd_intf_nets S_AXIS_1]
set_property HDL_ATTRIBUTE.MARK_DEBUG true [get_bd_intf_nets S_AXIS_1]
set_property HDL_ATTRIBUTE.DEBUG true [get_bd_intf_nets axi_dma_0_M_AXIS_MM2S]
set_property HDL_ATTRIBUTE.MARK_DEBUG true [get_bd_intf_nets axi_dma_0_M_AXIS_MM2S]
set_property HDL_ATTRIBUTE.DEBUG true [get_bd_nets axi_dma_0_mm2s_introut]
set_property HDL_ATTRIBUTE.MARK_DEBUG true [get_bd_nets axi_dma_0_mm2s_introut]
set_property HDL_ATTRIBUTE.DEBUG true [get_bd_nets axi_dma_0_s2mm_introut]
set_property HDL_ATTRIBUTE.MARK_DEBUG true [get_bd_nets axi_dma_0_s2mm_introut]
set_property HDL_ATTRIBUTE.DEBUG true [get_bd_nets clk_dynamic_locked]
set_property HDL_ATTRIBUTE.MARK_DEBUG true [get_bd_nets clk_dynamic_locked]
set_property HDL_ATTRIBUTE.DEBUG true [get_bd_nets psclk_1]
set_property HDL_ATTRIBUTE.MARK_DEBUG true [get_bd_nets psclk_1]
set_property HDL_ATTRIBUTE.DEBUG true [get_bd_nets psen_1]
set_property HDL_ATTRIBUTE.MARK_DEBUG true [get_bd_nets psen_1]
set_property HDL_ATTRIBUTE.DEBUG true [get_bd_nets psincdec_1]
set_property HDL_ATTRIBUTE.MARK_DEBUG true [get_bd_nets psincdec_1]
set_property HDL_ATTRIBUTE.DEBUG true [get_bd_nets Net]
set_property HDL_ATTRIBUTE.MARK_DEBUG true [get_bd_nets Net]
set_property HDL_ATTRIBUTE.DEBUG true [get_bd_nets Net1]
set_property HDL_ATTRIBUTE.MARK_DEBUG true [get_bd_nets Net1]
set_property HDL_ATTRIBUTE.DEBUG true [get_bd_nets axis_data_fifo_adc_almost_full]
set_property HDL_ATTRIBUTE.MARK_DEBUG true [get_bd_nets axis_data_fifo_adc_almost_full]
set_property HDL_ATTRIBUTE.DEBUG true [get_bd_nets axis_data_fifo_dac_almost_empty]
set_property HDL_ATTRIBUTE.MARK_DEBUG true [get_bd_nets axis_data_fifo_dac_almost_empty]
set_property HDL_ATTRIBUTE.DEBUG true [get_bd_nets axis_data_fifo_adc_almost_empty]
set_property HDL_ATTRIBUTE.MARK_DEBUG true [get_bd_nets axis_data_fifo_adc_almost_empty]
set_property HDL_ATTRIBUTE.DEBUG true [get_bd_nets prog_empty]
set_property HDL_ATTRIBUTE.MARK_DEBUG true [get_bd_nets prog_empty]
set_property HDL_ATTRIBUTE.DEBUG true [get_bd_nets prog_full]
set_property HDL_ATTRIBUTE.MARK_DEBUG true [get_bd_nets prog_full]
set_property HDL_ATTRIBUTE.DEBUG true [get_bd_nets prog_empty_1]
set_property HDL_ATTRIBUTE.MARK_DEBUG true [get_bd_nets prog_empty_1]
set_property HDL_ATTRIBUTE.DEBUG true [get_bd_nets probe8_1]
set_property HDL_ATTRIBUTE.DEBUG true [get_bd_nets probe9_1]
set_property HDL_ATTRIBUTE.DEBUG true [get_bd_nets probe10_1]
set_property HDL_ATTRIBUTE.DEBUG true [get_bd_nets psdone]
set_property HDL_ATTRIBUTE.MARK_DEBUG true [get_bd_nets psdone]
set_property HDL_ATTRIBUTE.DEBUG true [get_bd_nets mux_adc_fifo_reset1_data_out]
set_property HDL_ATTRIBUTE.MARK_DEBUG true [get_bd_nets mux_adc_fifo_reset1_data_out]
set_property HDL_ATTRIBUTE.DEBUG true [get_bd_nets mux_dac_fifo_reset1_data_out]
set_property HDL_ATTRIBUTE.MARK_DEBUG true [get_bd_nets mux_dac_fifo_reset1_data_out]
set_property HDL_ATTRIBUTE.DEBUG true [get_bd_nets s2mm_prmry_reset_out_n]
set_property HDL_ATTRIBUTE.MARK_DEBUG true [get_bd_nets s2mm_prmry_reset_out_n]
set_property HDL_ATTRIBUTE.DEBUG true [get_bd_nets mm2s_prmry_reset_out_n]
set_property HDL_ATTRIBUTE.MARK_DEBUG true [get_bd_nets mm2s_prmry_reset_out_n]
set_property HDL_ATTRIBUTE.DEBUG true [get_bd_nets prog_full_1]
set_property HDL_ATTRIBUTE.MARK_DEBUG true [get_bd_nets prog_full_1]
set_property HDL_ATTRIBUTE.DEBUG true [get_bd_nets probe26_1]
set_property HDL_ATTRIBUTE.DEBUG true [get_bd_nets probe28_1]

current_bd_instance /dac
connect_bd_intf_net -intf_net Conn1 [get_bd_intf_pins axis] [get_bd_intf_pins dac_axis_0/axis]
connect_bd_net [get_bd_pins DUCWrapper_0/io_out_dac] [get_bd_pins mux_reciever_out/sel1]
connect_bd_net -net clk_wiz_0_clk_out1 [get_bd_pins clk] [get_bd_pins DUCWrapper_0/io_clock] [get_bd_pins dac_axis_0/clk]
connect_bd_net -net rst_ps7_0_50M_peripheral_aresetn [get_bd_pins resetn] [get_bd_pins DUCWrapper_0/io_resetN] [get_bd_pins dac_axis_0/resetn]
connect_bd_net -net xlslice_dac_8_15_Dout [get_bd_pins div] [get_bd_pins dac_axis_0/div]
connect_bd_net -net xlslice_duc_sync_6_Dout [get_bd_pins io_in_sync] [get_bd_pins DUCWrapper_0/io_in_sync]
connect_bd_net -net xlslice_reciever_out_7_Dout [get_bd_pins router] [get_bd_pins mux_reciever_out/router]
connect_bd_net [get_bd_pins xlslice_sender/Dout] [get_bd_pins DUCWrapper_0/io_in_data]
connect_bd_net -net dac_axis_0_da_out [get_bd_pins dac_axis_0/da_out] \
  [get_bd_pins mux_reciever_out/sel2] [get_bd_pins xlslice_sender/Din] [get_bd_pins da_out]
connect_bd_net [get_bd_pins mux_reciever_out/data_out] [get_bd_pins mux_data_available/sel2]
connect_bd_net -net mux_0_data_out [get_bd_pins mux_data_available/data_out] [get_bd_pins da]
connect_bd_net [get_bd_pins xlconstant_0/dout] [get_bd_pins mux_data_available/sel1]
connect_bd_net [get_bd_pins dac_axis_0/axis_tvalid_output] [get_bd_pins mux_data_available/router]
set_property HDL_ATTRIBUTE.DEBUG true [get_bd_intf_nets Conn1]
set_property HDL_ATTRIBUTE.DEBUG true [get_bd_nets dac_axis_0_da_out]
set_property HDL_ATTRIBUTE.MARK_DEBUG true [get_bd_nets dac_axis_0_da_out]
set_property HDL_ATTRIBUTE.DEBUG true [get_bd_nets mux_0_data_out]

current_bd_instance /debug_ctrl
connect_bd_intf_net [get_bd_intf_pins S_AXI] [get_bd_intf_pins axi_gpio_0/S_AXI]
connect_bd_net [get_bd_pins axi_gpio_0/gpio2_io_o] \
  [get_bd_pins xlslice_clk_psclk_3/Din] [get_bd_pins xlslice_clk_psen_4/Din] [get_bd_pins xlslice_clk_psincdec_5/Din] \
  [get_bd_pins xlslice_count_trigger_clear_0/Din] [get_bd_pins xlslice_ddc_sync_8/Din] [get_bd_pins xlslice_duc_sync_6/Din] \
  [get_bd_pins xlslice_fifo_read_start_2/Din] [get_bd_pins xlslice_fifo_write_start_1/Din] \
  [get_bd_pins xlslice_reciever_in_9/Din] [get_bd_pins xlslice_reciever_out_7/Din] \
  [get_bd_pins xlslice_adc_fifo_reset_10/Din] [get_bd_pins xlslice_dac_fifo_reset_11/Din]
connect_bd_net [get_bd_pins axi_gpio_0/gpio_io_o] \
  [get_bd_pins xlslice_adc_0_7/Din] [get_bd_pins xlslice_counter_trigger_16_31/Din] [get_bd_pins xlslice_dac_8_15/Din]
connect_bd_net -net clk_wiz_0_clk_out1 [get_bd_pins s_axi_aclk] [get_bd_pins axi_gpio_0/s_axi_aclk]
connect_bd_net -net rst_ps7_0_50M_peripheral_aresetn [get_bd_pins s_axi_aresetn] [get_bd_pins axi_gpio_0/s_axi_aresetn]
connect_bd_net -net xlslice_adc_0_7_Dout [get_bd_pins xlslice_adc_0_7/Dout] [get_bd_pins Dout13]
connect_bd_net -net xlslice_clk_psclk_3_Dout [get_bd_pins xlslice_clk_psclk_3/Dout] [get_bd_pins Dout2]
connect_bd_net -net xlslice_clk_psen_4_Dout [get_bd_pins xlslice_clk_psen_4/Dout] [get_bd_pins Dout1]
connect_bd_net -net xlslice_clk_psincdec_5_Dout [get_bd_pins xlslice_clk_psincdec_5/Dout] [get_bd_pins Dout6]
connect_bd_net [get_bd_pins xlslice_dac_8_15/Dout] [get_bd_pins Dout12]
connect_bd_net [get_bd_pins xlslice_duc_sync_6/Dout] [get_bd_pins Dout]
connect_bd_net -net xlslice_reciever_in_10_Dout [get_bd_pins xlslice_reciever_in_9/Dout] [get_bd_pins Dout11]
connect_bd_net [get_bd_pins xlslice_reciever_out_7/Dout] [get_bd_pins Dout3]
connect_bd_net -net xlslice_reciever_out_8_Dout [get_bd_pins xlslice_ddc_sync_8/Dout] [get_bd_pins Dout7]
connect_bd_net -net xlslice_adc_fifo_reset_10_Dout [get_bd_pins xlslice_adc_fifo_reset_10/Dout] [get_bd_pins Dout4]
connect_bd_net -net xlslice_dac_fifo_reset_11_Dout [get_bd_pins xlslice_dac_fifo_reset_11/Dout] [get_bd_pins Dout14]
set_property HDL_ATTRIBUTE.DEBUG true [get_bd_nets xlslice_adc_0_7_Dout]
set_property HDL_ATTRIBUTE.DEBUG true [get_bd_nets xlslice_clk_psclk_3_Dout]
set_property HDL_ATTRIBUTE.DEBUG true [get_bd_nets xlslice_clk_psen_4_Dout]
set_property HDL_ATTRIBUTE.DEBUG true [get_bd_nets xlslice_clk_psincdec_5_Dout]
set_property HDL_ATTRIBUTE.DEBUG true [get_bd_nets xlslice_reciever_in_10_Dout]
set_property HDL_ATTRIBUTE.DEBUG true [get_bd_nets xlslice_adc_fifo_reset_10_Dout]
set_property HDL_ATTRIBUTE.MARK_DEBUG true [get_bd_nets xlslice_adc_fifo_reset_10_Dout]
set_property HDL_ATTRIBUTE.DEBUG true [get_bd_nets xlslice_dac_fifo_reset_11_Dout]

current_bd_instance /
connect_bd_intf_net -intf_net axis1_1 [get_bd_intf_pins dac/axis] [get_bd_intf_pins core/M_AXIS]
connect_bd_intf_net -intf_net processing_system7_0_DDR [get_bd_intf_ports DDR] [get_bd_intf_pins core/DDR]
connect_bd_intf_net -intf_net processing_system7_0_FIXED_IO [get_bd_intf_ports FIXED_IO] [get_bd_intf_pins core/FIXED_IO]
connect_bd_intf_net -intf_net adc_axis2 [get_bd_intf_pins adc/axis_adc] [get_bd_intf_pins core/S_AXIS]
connect_bd_intf_net [get_bd_intf_pins core/M00_AXI] [get_bd_intf_pins debug_ctrl/S_AXI]
connect_bd_net [get_bd_ports ad] [get_bd_pins adc/ad]
connect_bd_net -net clk_dynamic_clk_out_200M [get_bd_pins core/clk_out_dynamic] [get_bd_ports clk_da_dynamic] [get_bd_pins adc/io_clock]
connect_bd_net [get_bd_ports clk_pl_50M] [get_bd_pins core/clk_pl_50M]
connect_bd_net -net clk_wiz_0_clk_out1 [get_bd_pins core/clk_out1] \
  [get_bd_ports clk_ad_static] [get_bd_pins adc/clk] [get_bd_pins dac/clk] [get_bd_pins debug_ctrl/s_axi_aclk]
connect_bd_net -net debug_ctrl_Dout1 [get_bd_pins debug_ctrl/Dout1] [get_bd_pins core/psen]
connect_bd_net -net debug_ctrl_Dout2 [get_bd_pins debug_ctrl/Dout2] [get_bd_pins core/psclk]
connect_bd_net -net debug_ctrl_Dout6 [get_bd_pins debug_ctrl/Dout6] [get_bd_pins core/psincdec]
connect_bd_net -net div_1 [get_bd_pins debug_ctrl/Dout13] [get_bd_pins adc/div] [get_bd_pins core/probe8]
connect_bd_net -net mux_0_data_out [get_bd_pins dac/da] [get_bd_ports da] [get_bd_pins core/probe26]
connect_bd_net -net reset_dynamic_peripheral_aresetn [get_bd_pins core/peripheral_aresetn] [get_bd_pins adc/io_resetN]
connect_bd_net -net rst_ps7_0_50M_peripheral_aresetn [get_bd_pins core/peripheral_aresetn1] \
  [get_bd_pins adc/resetn] [get_bd_pins dac/resetn] [get_bd_pins debug_ctrl/s_axi_aresetn]
connect_bd_net -net xlslice_dac_8_15_Dout [get_bd_pins debug_ctrl/Dout12] [get_bd_pins dac/div]
connect_bd_net -net xlslice_duc_sync_6_Dout [get_bd_pins debug_ctrl/Dout] [get_bd_pins dac/io_in_sync]
connect_bd_net -net xlslice_reciever_in_10_Dout [get_bd_pins debug_ctrl/Dout11] [get_bd_pins adc/router] [get_bd_pins core/probe10]
connect_bd_net -net xlslice_reciever_out_7_Dout [get_bd_pins debug_ctrl/Dout3] [get_bd_pins dac/router]
connect_bd_net -net xlslice_reciever_out_8_Dout [get_bd_pins debug_ctrl/Dout7] [get_bd_pins adc/io_in_sync]
connect_bd_net -net debug_ctrl_Dout4 [get_bd_pins debug_ctrl/Dout4] [get_bd_pins core/router]
connect_bd_net -net debug_ctrl_Dout14 [get_bd_pins debug_ctrl/Dout14] [get_bd_pins core/router1]
connect_bd_net -net probe9_1 [get_bd_pins adc/data_out] [get_bd_pins core/probe9]
connect_bd_net -net probe28_1 [get_bd_pins dac/da_out] [get_bd_pins core/probe28]
connect_bd_net -net core_almost_empty [get_bd_pins core/almost_empty] [get_bd_pins adc/fifo_almost_empty]
connect_bd_net -net core_prog_full1 [get_bd_pins core/prog_full1] [get_bd_pins adc/fifo_almost_full1]
set_property HDL_ATTRIBUTE.DEBUG true [get_bd_intf_nets axis1_1]
set_property HDL_ATTRIBUTE.DEBUG true [get_bd_intf_nets adc_axis2]
set_property HDL_ATTRIBUTE.DEBUG true [get_bd_nets debug_ctrl_Dout1]
set_property HDL_ATTRIBUTE.DEBUG true [get_bd_nets debug_ctrl_Dout2]
set_property HDL_ATTRIBUTE.DEBUG true [get_bd_nets debug_ctrl_Dout6]
set_property HDL_ATTRIBUTE.DEBUG true [get_bd_nets div_1]
set_property HDL_ATTRIBUTE.DEBUG true [get_bd_nets mux_0_data_out]
set_property HDL_ATTRIBUTE.MARK_DEBUG true [get_bd_nets mux_0_data_out]
set_property HDL_ATTRIBUTE.DEBUG true [get_bd_nets xlslice_reciever_in_10_Dout]
set_property HDL_ATTRIBUTE.DEBUG true [get_bd_nets debug_ctrl_Dout4]
set_property HDL_ATTRIBUTE.MARK_DEBUG true [get_bd_nets debug_ctrl_Dout4]
set_property HDL_ATTRIBUTE.DEBUG true [get_bd_nets debug_ctrl_Dout14]
set_property HDL_ATTRIBUTE.DEBUG true [get_bd_nets probe9_1]
set_property HDL_ATTRIBUTE.DEBUG true [get_bd_nets probe28_1]
set_property HDL_ATTRIBUTE.DEBUG true [get_bd_nets core_almost_empty]
set_property HDL_ATTRIBUTE.DEBUG true [get_bd_nets core_prog_full1]

# ---- address map ----
assign_bd_address -offset 0x00000000 -range 512M -target_address_space [get_bd_addr_spaces core/axi_dma_0/Data_MM2S] [get_bd_addr_segs core/processing_system7_0/S_AXI_HP0/HP0_DDR_LOWOCM]
assign_bd_address -offset 0x00000000 -range 512M -target_address_space [get_bd_addr_spaces core/axi_dma_0/Data_S2MM] [get_bd_addr_segs core/processing_system7_0/S_AXI_HP0/HP0_DDR_LOWOCM]
assign_bd_address -offset 0x40400000 -range 64K -target_address_space [get_bd_addr_spaces core/processing_system7_0/Data] [get_bd_addr_segs core/axi_dma_0/S_AXI_LITE/Reg]
assign_bd_address -offset 0x41200000 -range 64K -target_address_space [get_bd_addr_spaces core/processing_system7_0/Data] [get_bd_addr_segs debug_ctrl/axi_gpio_0/S_AXI/Reg]

validate_bd_design
save_bd_design
